# Altium schematic sheet DigitalLabBoard_Traffic.SchDoc
size A4
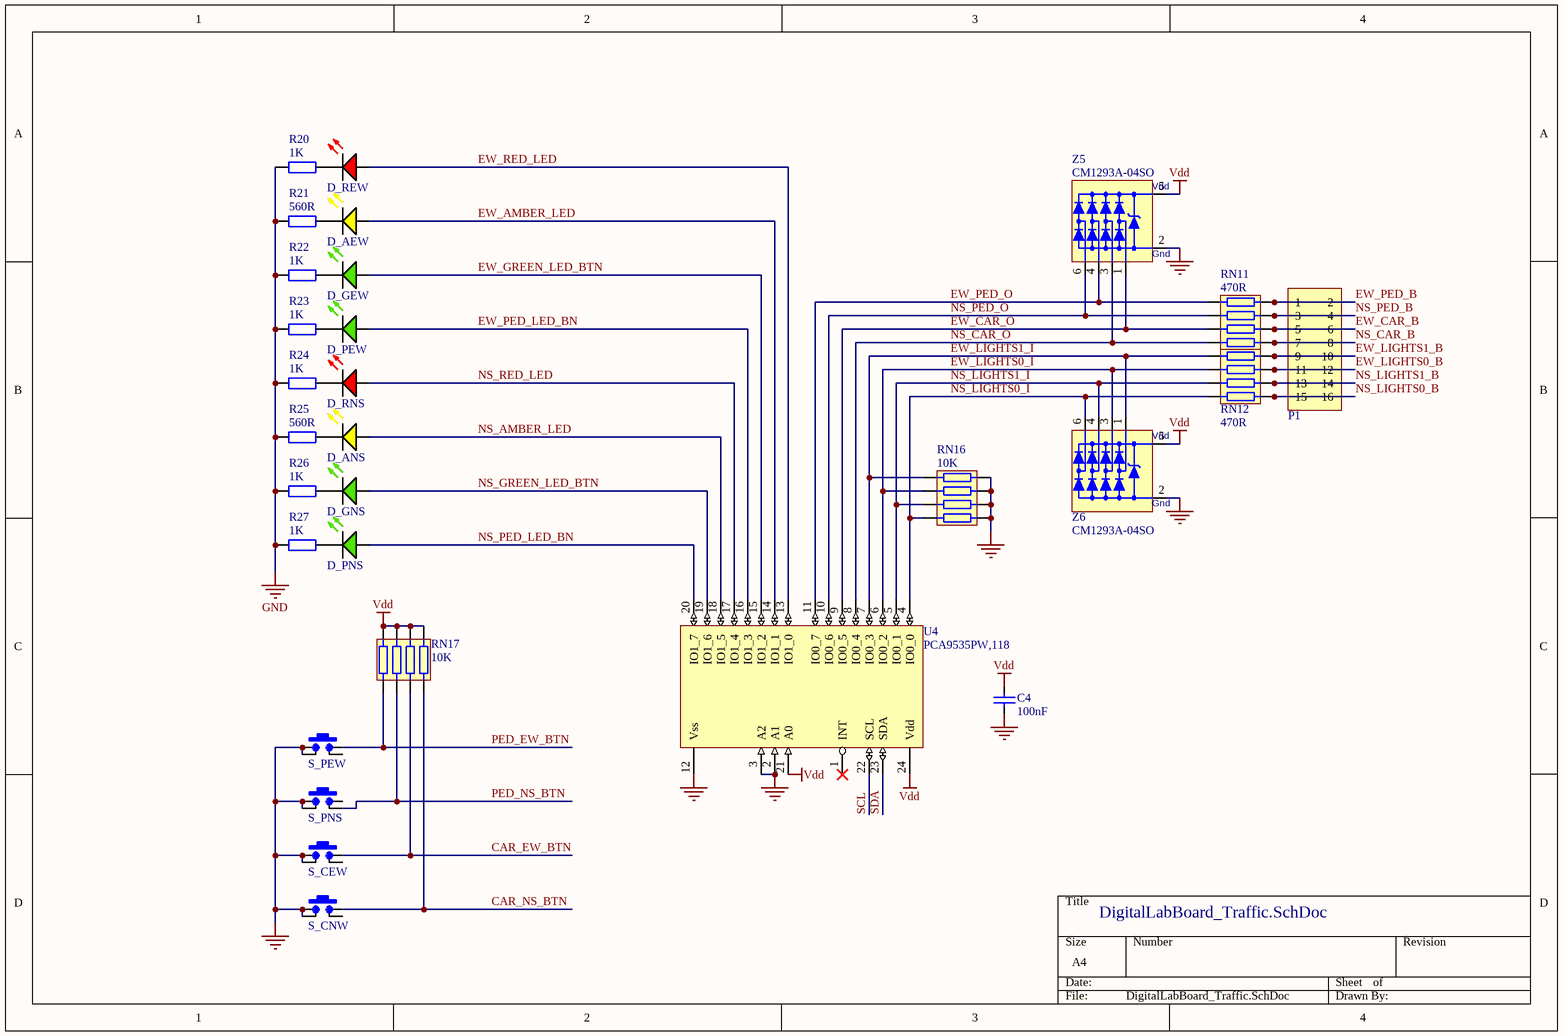
[diagram p0: DigitalLabBoard_Traffic.SchDoc]

## Parts
C4  100nF  [CCNP1608-0603]
D_AEW  LED Yellow  [LED1608-0603-Yellow]  (value not drawn)
D_ANS  LED Yellow  [LED1608-0603-Yellow]  (value not drawn)
D_GEW  LED Green  [LED1608-0603-GREEN]  (value not drawn)
D_GNS  LED Green  [LED1608-0603-GREEN]  (value not drawn)
D_PEW  LED Green  [LED1608-0603-GREEN]  (value not drawn)
D_PNS  LED Green  [LED1608-0603-GREEN]  (value not drawn)
D_REW  LED Red  [LED1608-0603-RED]  (value not drawn)
D_RNS  LED Red  [LED1608-0603-RED]  (value not drawn)
P1  Header 2x8  [HDR2X8S]  (value not drawn)
R20  1K  [CR1608-0603]
R21  560R  [CR1608-0603]
R22  1K  [CR1608-0603]
R23  1K  [CR1608-0603]
R24  1K  [CR1608-0603]
R25  560R  [CR1608-0603]
R26  1K  [CR1608-0603]
R27  1K  [CR1608-0603]
RN11  470R  [CR1206-0603_X4_N]
RN12  470R  [CR1206-0603_X4_N]
RN16  10K  [CR1206-0603_X4_N]
RN17  10K  [CR1206-0603_X4_N]
S_CEW  SMD-SW-4_5.1x5.1x2.0_M  [SMD-SW-4_5.1x5.1x2.0_M]  (value not drawn)
S_CNW  SMD-SW-4_5.1x5.1x2.0_M  [SMD-SW-4_5.1x5.1x2.0_M]  (value not drawn)
S_PEW  SMD-SW-4_5.1x5.1x2.0_M  [SMD-SW-4_5.1x5.1x2.0_M]  (value not drawn)
S_PNS  SMD-SW-4_5.1x5.1x2.0_M  [SMD-SW-4_5.1x5.1x2.0_M]  (value not drawn)
U4  PCA9535PW,118  [TSSOP24_N]
Z5  CM1293A-04SO  [SOT457_N]
Z6  CM1293A-04SO  [SOT457_N]

## Nets
GND: C4.1 R20.1 R21.1 R22.1 R23.1 R24.1 R25.1 R26.1 R27.1 RN16.5 RN16.6 RN16.7 RN16.8 S_CEW.1 S_CEW.1b S_CNW.1 S_CNW.1b S_PEW.2 S_PEW.2b S_PNS.1 S_PNS.1b U4.2(A1) U4.3(A2) U4.12(Vss) Z5.2 Z6.2(Vn)
Vdd: C4.2 RN17.1 RN17.2 RN17.3 RN17.4 U4.21(A0) U4.24(Vdd) Z5.5 Z6.5(Vp)
CAR_EW_BTN: RN17.6 S_CEW.2b
CAR_NS_BTN: RN17.5 S_CNW.2b
EW_AMBER_LED: D_AEW.A U4.14(IO1_1)
EW_CAR_B: P1.5 P1.6 RN11.7
EW_CAR_O: RN11.2 U4.9(IO0_5) Z5.1
EW_GREEN_LED_BTN: D_GEW.A U4.15(IO1_2)
EW_LIGHTS0_B: P1.11 P1.12 RN12.6
EW_LIGHTS0_I: RN12.3 RN16.3 U4.6(IO0_2) Z6.3
EW_LIGHTS1_B: P1.9 P1.10 RN12.5
EW_LIGHTS1_I: RN12.4 RN16.4 U4.7(IO0_3) Z6.1
EW_PED_B: P1.1 P1.2 RN11.5
EW_PED_LED_BN: D_PEW.A U4.16(IO1_3)
EW_PED_O: RN11.4 U4.11(IO0_7) Z5.4
EW_RED_LED: D_REW.A U4.13(IO1_0)
NS_AMBER_LED: D_ANS.A U4.18(IO1_5)
NS_CAR_B: P1.7 P1.8 RN11.8
NS_CAR_O: RN11.1 U4.8(IO0_4) Z5.3
NS_GREEN_LED_BTN: D_GNS.A U4.19(IO1_6)
NS_LIGHTS0_B: P1.15 P1.16 RN12.8
NS_LIGHTS0_I: RN12.1 RN16.1 U4.4(IO0_0) Z6.6
NS_LIGHTS1_B: P1.13 P1.14 RN12.7
NS_LIGHTS1_I: RN12.2 RN16.2 U4.5(IO0_1) Z6.4
NS_PED_B: P1.3 P1.4 RN11.6
NS_PED_LED_BN: D_PNS.A U4.20(IO1_7)
NS_PED_O: RN11.3 U4.10(IO0_6) Z5.6
NS_RED_LED: D_RNS.A U4.17(IO1_4)
PED_EW_BTN: RN17.8 S_PEW.1b
PED_NS_BTN: RN17.7 S_PNS.2
SCL: U4.22(SCL)
SDA: U4.23(SDA)
NetD_AEW_K: D_AEW.K R21.2
NetD_ANS_K: D_ANS.K R25.2
NetD_GEW_K: D_GEW.K R22.2
NetD_GNS_K: D_GNS.K R26.2
NetD_PEW_K: D_PEW.K R23.2
NetD_PNS_K: D_PNS.K R27.2
NetD_REW_K: D_REW.K R20.2
NetD_RNS_K: D_RNS.K R24.2

Not connected (* = marked no-connect by the designer): S_CEW 2; S_CNW 2; S_PEW 1; S_PNS 2b; U4 1(INT)*

## Notes on the sheet
- (in symbol CM1293A-04SO) Vdd; Gnd

## Library data of the parts
C4 = Cap_CCNP_0603: Capacitor non-polar SMT 0603; Manufacturer: Generic Components; Class: Passive; Published: 08/06/2000; Publisher: Altium Hobart Technology Centre; SubClass: Capacitor; Farnell PN: *; Digikey: *; Value: 100nF; LCSC: C14663
D_AEW D_ANS = LED-0603-Yellow: LED 0603 Yellow; Manufacturer: Generic Components; Class I: Optoelectronic; Published: 8-Jun-2000; Revision: July-2002: Re-released for DXP Platform.; Publisher: Altium Limited; Class II: LED; Farnell PN: 5790852; Digikey: *; LCSC: C72038
D_GEW D_GNS D_PEW D_PNS = LED-0603-Green: LED 0603 Green; Manufacturer: Generic Components; Class I: Optoelectronic; Published: 8-Jun-2000; Revision: July-2002: Re-released for DXP Platform.; Publisher: Altium Limited; Class II: LED; Farnell PN: 1581242; Digikey: *; LCSC: C72043
D_REW D_RNS = LED-0603-Red: LED 0603 Red; Manufacturer: Generic Components; Class I: Optoelectronic; Published: 8-Jun-2000; Revision: July-2002: Re-released for DXP Platform.; Publisher: Altium Limited; Class II: LED; Farnell PN: 1581239; Digikey: *; LCSC: C2286
R20-R27 = Res_CR0603: Resistor SMT 0603; Manufacturer: Generic Components; Class: Passive; Published: 08/06/2000; Publisher: Altium Hobart Technology Centre; SubClass: Resistor; Farnell PN: *; Digikey: *
  R20 R22-R24 R26 R27: Value: 1K; LCSC: C21190
  R21 R25: Value: 560R; LCSC: C23204
RN11 RN12 = ResistorNetwork_CR0603x4: SMT x4 Resistor Array; Value: 470 ohm; Farnell PN: *; Digikey: *; LCSC: C25510
RN16 RN17 = ResistorNetwork_CR0603x4: SMT x4 Resistor Array; Farnell PN: *; Digikey: *; Value: 10K; LCSC: C29718
S_CEW S_CNW S_PEW S_PNS = SW_PB-TS: Tactile Switch SPST 5.10mm X 5.10mm / (1.5mm=C318884) / (2.0mm=C318888) / (3.5mm=C318886); Revision: 1.0; LCSC: C318888
U4 = PCA9535PW,118: 16-bit I2C I/O Expander (TSSOP24) / NO PUPs on I/O pins; Farnell PN: 2776149; Digikey: 568-10296-1-ND; LCSC: C255606
Z5 Z6 = CM1293A-04SO: Ultra low capacitance quadruple rail-to-rail ESD protection; Farnell PN: 2533258; Digikey: CM1293A-04SOOSCT-ND; LCSC: C393377
P1 = Header 2x8: Digikey: A26528-08-ND